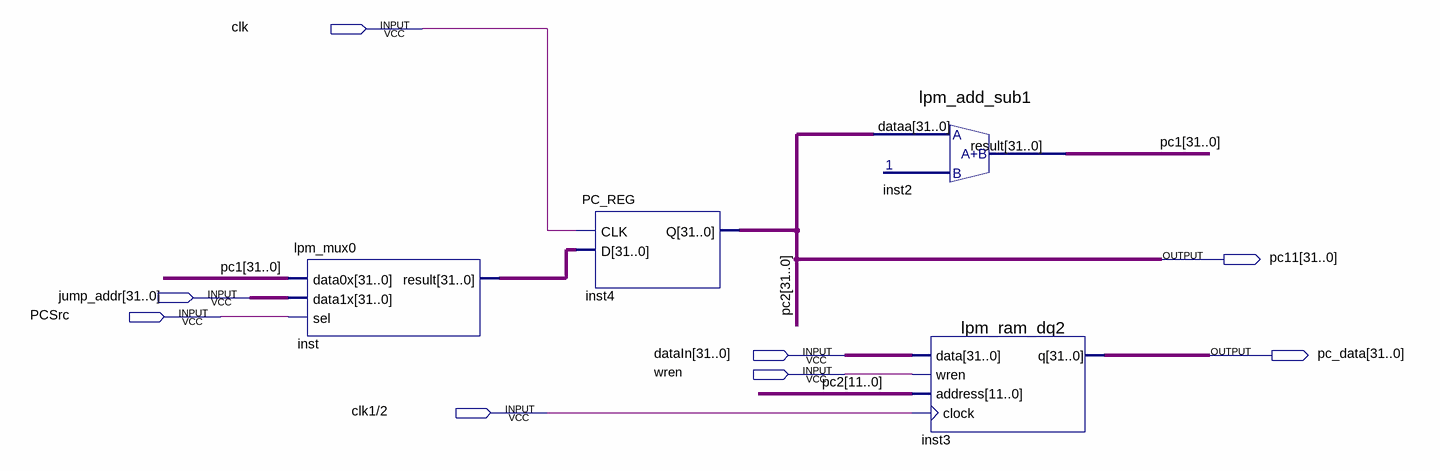
[diagram p0: schematic sheet]
// Quartus schematic part1.bdf as structural Verilog: 4 symbols, 8 pins
module part1 (
  input  clk,
  input  [31:0] jump_addr,
  input  PCSrc,
  input  [31:0] dataIn,
  input  wren,
  input  \clk1/2 ,
  output [31:0] pc11,
  output [31:0] pc_data
);

  wire [31:0] inst_result, pc1;

  lpm_mux0 inst (.data0x(pc1), .data1x(jump_addr), .sel(PCSrc), .result(inst_result));
  PC_REG inst4 (.CLK(clk), .D(inst_result), .Q(pc11));
  lpm_add_sub1 inst2 (.dataa(pc11), .result(pc1));
  lpm_ram_dq2 inst3 (.data(dataIn), .wren(wren), .address(pc11[11:0]), .clock(\clk1/2 ), .q(pc_data));

  // Other names for the same wires on the sheet: pc2[31:0] = pc11
endmodule
